# Altium project EVB_r2-1.PrjPCB (part 1 of 2)
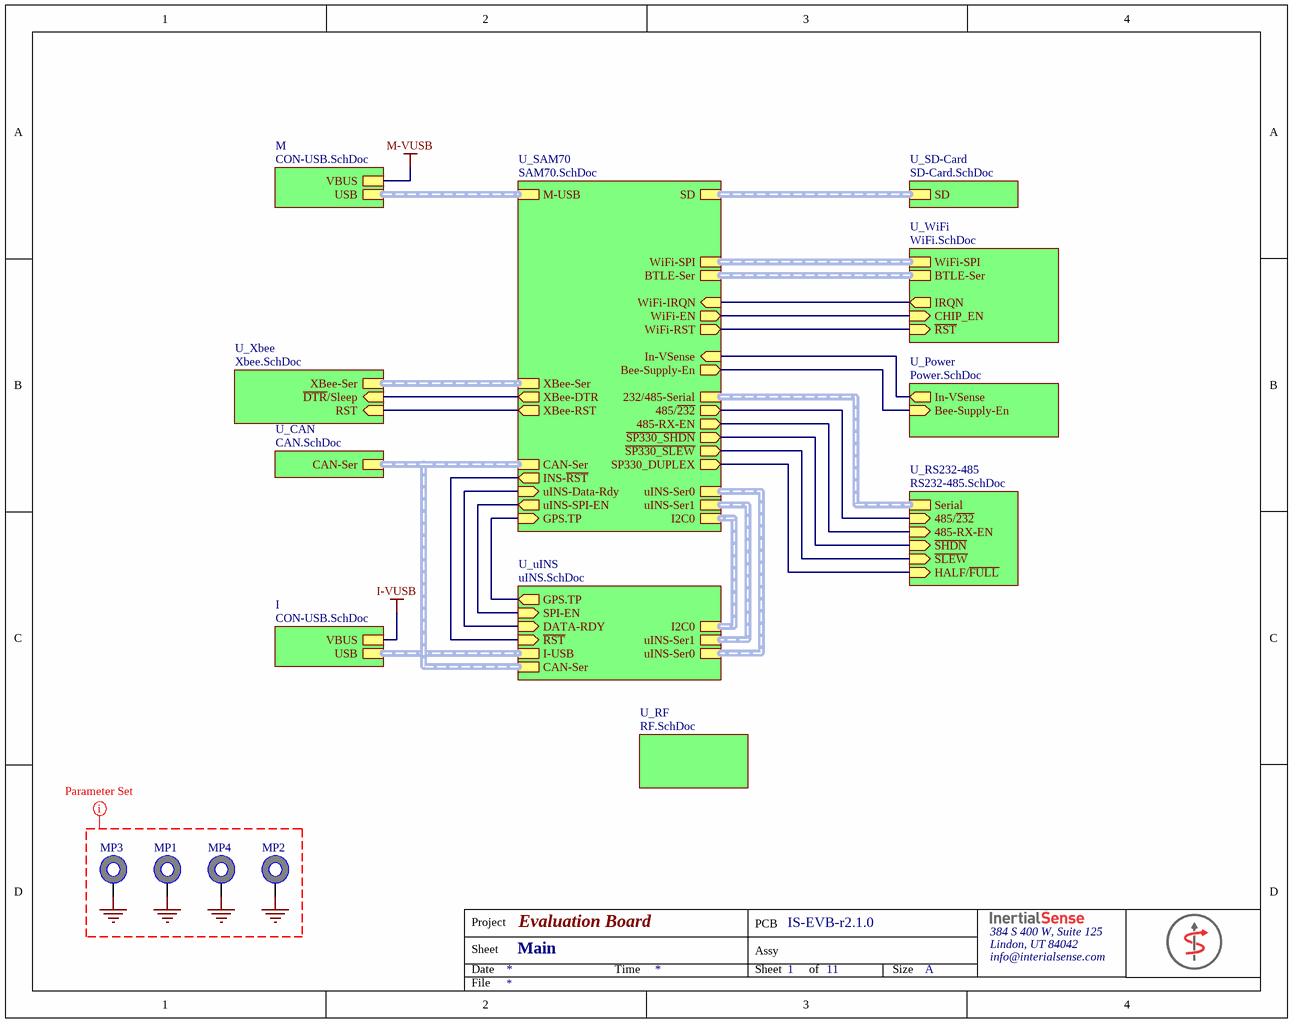
[diagram p0: Main.SchDoc]
AddressLine1: 384 S 400 W, Suite 125; AddressLine2: Lindon, UT 84042; AddressLine3: info@interialsense.com; Company: Inertial Sense, Inc.; PcbPartNumber: IS-EVB-r2.1.0; PcbRevision: 2.1; ProjectTitle: Evaluation Board
6 sheets, 107 parts. Net scope: hierarchical (ports join the sheet entries above them; power ports are global).
Board file: EVB-2.PCBDOC
Sheets:
  Main.SchDoc
    U_CAN = CAN.SchDoc
    U_SAM70 = SAM70.SchDoc
    U_uINS = uINS.SchDoc
    U_Xbee = Xbee.SchDoc
    M = CON-USB.SchDoc
    I = CON-USB.SchDoc

## Sheet Main.SchDoc: Main
size A; DocumentNumber: 1; SheetNumber: 1; SheetTotal: 11

### Parts
MP1  Standoff  [9774050151R]  (value not drawn)
MP2  Standoff  [9774050151R]  (value not drawn)
MP3  Standoff  [9774050151R]  (value not drawn)
MP4  Standoff  [9774050151R]  (value not drawn)

### Sub-sheets
I = CON-USB.SchDoc: USB (harness USB), VBUS
M = CON-USB.SchDoc: USB (harness USB), VBUS
U_CAN = CAN.SchDoc: CAN-Ser (harness CAN)
U_Power = Power.SchDoc (file not in this document): Bee-Supply-En (in), In-VSense (out)
U_RF = RF.SchDoc (file not in this document): no entries
U_RS232-485 = RS232-485.SchDoc (file not in this document): Serial (harness UART), 485/~{232} (in), 485-RX-EN (in), ~{SHDN} (in), ~{SLEW} (in), HALF/~{FULL} (in)
U_SAM70 = SAM70.SchDoc: M-USB (harness USB), I2C0 (harness I2C), CAN-Ser (harness CAN), uINS-Ser0 (harness UART), XBee-Ser (harness UART), uINS-Ser1 (harness USART), WiFi-SPI (harness SPI), BTLE-Ser (harness UART), SD (harness SDIO), XBee-DTR (out), WiFi-IRQN (in), WiFi-EN (out), WiFi-RST (out), XBee-RST (out), Bee-Supply-En (out), uINS-SPI-EN (out), 485/~{232} (out), uINS-Data-Rdy (in), GPS.TP (in), 232/485-Serial (harness UART), 485-RX-EN (out), ~{SP330_SHDN} (out), ~{SP330_SLEW} (out), SP330_DUPLEX (out), INS-~{RST} (out), In-VSense (in)
U_SD-Card = SD-Card.SchDoc (file not in this document): SD (harness SDIO)
U_uINS = uINS.SchDoc: uINS-Ser0 (harness UART), uINS-Ser1 (harness USART), I-USB (harness USB), I2C0 (harness I2C), ~{RST} (in), SPI-EN (in), DATA-RDY (in), GPS.TP (out), CAN-Ser (harness CAN)
U_WiFi = WiFi.SchDoc (file not in this document): CHIP_EN (in), WiFi-SPI (harness SPI), BTLE-Ser (harness UART), ~{RST} (in), IRQN (out)
U_Xbee = Xbee.SchDoc: RST (in), XBee-Ser (harness UART), ~{DTR}/Sleep (in)

### Nets
GND: MP1.1 MP2.1 MP3.1 MP4.1
485-RX-EN: sheet U_RS232-485/485-RX-EN, sheet U_SAM70/485-RX-EN
485/~{232}-SEL: sheet U_RS232-485/485/~{232}, sheet U_SAM70/485/~{232}
~{SP330-SHDN}: sheet U_RS232-485/~{SHDN}, sheet U_SAM70/~{SP330_SHDN}
GPS.TIMEPULSE: sheet U_SAM70/GPS.TP, sheet U_uINS/GPS.TP
I-DATA-RDY: sheet U_SAM70/uINS-Data-Rdy, sheet U_uINS/DATA-RDY
In-VSense: sheet U_Power/In-VSense, sheet U_SAM70/In-VSense
INS-~{RST}: sheet U_SAM70/INS-~{RST}, sheet U_uINS/~{RST}
SP330-DUPLEX: sheet U_RS232-485/HALF/~{FULL}, sheet U_SAM70/SP330_DUPLEX
SP330-SLEW: sheet U_RS232-485/~{SLEW}, sheet U_SAM70/~{SP330_SLEW}
uINS-SPI-EN: sheet U_SAM70/uINS-SPI-EN, sheet U_uINS/SPI-EN
WiFi-EN: sheet U_SAM70/WiFi-EN, sheet U_WiFi/CHIP_EN
WiFi-IRQN: sheet U_SAM70/WiFi-IRQN, sheet U_WiFi/IRQN
WiFi-RST: sheet U_SAM70/WiFi-RST, sheet U_WiFi/~{RST}
XBee-DTR: sheet U_SAM70/XBee-DTR, sheet U_Xbee/~{DTR}/Sleep
XBee-RST: sheet U_SAM70/XBee-RST, sheet U_Xbee/RST
XBee-Supply-En: sheet U_Power/Bee-Supply-En, sheet U_SAM70/Bee-Supply-En

### Buses and harness runs
harness sheet I/USB = sheet U_uINS/I-USB
harness sheet M/USB = sheet U_SAM70/M-USB
harness sheet U_CAN/CAN-Ser = sheet U_SAM70/CAN-Ser = sheet U_uINS/CAN-Ser
harness sheet U_RS232-485/Serial = sheet U_SAM70/232/485-Serial
harness sheet U_SAM70/BTLE-Ser = sheet U_WiFi/BTLE-Ser
harness sheet U_SAM70/I2C0 = sheet U_uINS/I2C0
harness sheet U_SAM70/SD = sheet U_SD-Card/SD
harness sheet U_SAM70/uINS-Ser0 = sheet U_uINS/uINS-Ser0
harness sheet U_SAM70/uINS-Ser1 = sheet U_uINS/uINS-Ser1
harness sheet U_SAM70/WiFi-SPI = sheet U_WiFi/WiFi-SPI
harness sheet U_SAM70/XBee-Ser = sheet U_Xbee/XBee-Ser

### Layout directives
net class Mounting Holes: GND

### Notes on the sheet
- Date
- Sheet
- Project
- Time
- PCB
- Assy
- of
- Size
- A
- File

### Library data of the parts
MP1-MP4 = Standoff: RND STANDOFF M2.5X0.45 STEEL 5MM; Manufacturer: Wurth Electronics; Manufacturer Part Number: 9774050951R; Plating: Tin; Threaded/Unthreaded: Unthreaded; Inside Diameter: 0.106inch; Outside Diameter: 0.201inch; Supplier 1: Digi-Key; Supplier Part Number 1: 732-7098-1-ND; Stock 1: 2378; Pricing 1: 1=0.95, 10=0.918, 50=0.795, 100=0.739 (USD); Material: Steel; Length: 0.252inch; REACH SVHC: Unknown

## Sheet CAN.SchDoc: CAN Transceiver
size A; DocumentNumber: 7; SheetNumber: 7; SheetTotal: 11
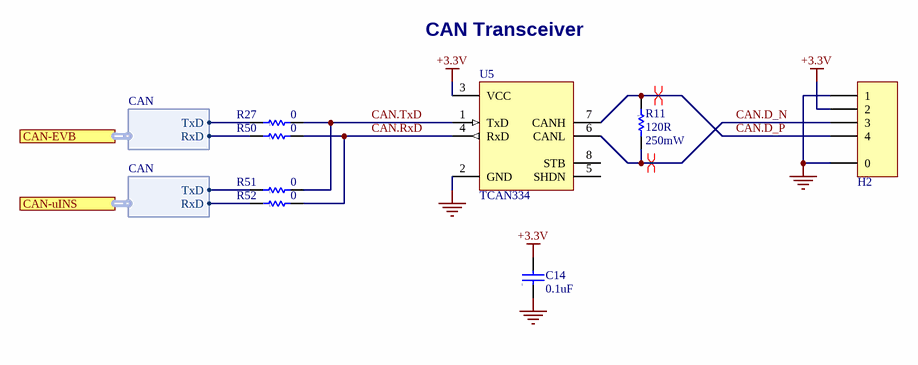
[diagram p1: CAN.SchDoc]

### Parts
C14  value 0.1uF  [0402]  (hidden comment: Cap)
H2  Hdr - 4pin - mount  [SM04B-GHS-TB(LF)(SN)]  (value not drawn)
R11  value 120R  Max Power Dissipation: 250mW  [R0603]  (hidden comment: Res)
R27  value 0  [R0402]  (hidden comment: Res)
R50  value 0  [R0402]  (hidden comment: Res)
R51  value 0  [R0402]  (hidden comment: Res)
R52  value 0  [R0402]  (hidden comment: Res)
U5  TCAN334  [SOT23-8-65P280X145-8N]

### Ports
CAN-EVB (harness CAN), CAN-uINS (harness CAN)

### Harnesses
CAN: TxD, RxD

### Nets
+3.3V: C14.2 H2.2 U5.3(VCC)
GND: C14.1 H2.0 H2.1 U5.2(GND)
CAN.D_N: H2.3 R11.2 U5.6(CANL)
CAN.D_P: H2.4 R11.1 U5.7(CANH)
CAN.RxD: R50.2 R52.2 U5.4(RxD)
CAN.TxD: R27.2 R51.2 U5.1(TxD)
NetR27_1: R27.1 ; port CAN-EVB.TxD
NetR50_1: R50.1 ; port CAN-EVB.RxD
NetR51_1: R51.1 ; port CAN-uINS.TxD
NetR52_1: R52.1 ; port CAN-uINS.RxD

Not connected (* = marked no-connect by the designer): U5 5(SHDN) 8(STB)

### Buses and harness runs
harness  = port CAN-EVB
harness  = port CAN-uINS

### Layout directives
differential pair; differential pair class CAN: CAN.D_N, CAN.D_P

### Notes on the sheet
- CAN Transceiver
- Date
- Sheet
- Project
- Time
- PCB
- Assy
- of
- Size
- A
- File

### Library data of the parts
C14 = Cap: CAP CER .10UF 50V X7R 10% 0402; Manufacturer: TDK Corporation; Manufacturer Part Number: C1005X7R1H104K; Capacitance: 0.1µF; Published: 8-Jun-2000; LatestRevisionDate: 17-Jul-2002; LatestRevisionNote: Re-released for DXP Platform.; Publisher: Altium Limited; Category: Capacitors; Supplier 1: Digi-Key; Supplier Part Number 1: 445-5932-1-ND; RoHS: RoHS Compliant; Stock 1: 174080; Pricing 1: 1=0.3, 10=0.2, 100=0.08, 250=0.05752, 500=0.041, 1000=0.03 (USD); Voltage - Rated: 50V; Tolerance: ±10%; Temperature Coefficient: X7R; Mounting Type: Surface Mount, MLCC; Operating Temperature: -55°C ~ 125°C; Applications: General Purpose; Ratings: -; Package / Case: 0402 (1005 Metric); Size / Dimension: 0.039" L x 0.020" W (1.00mm x 0.50mm); Height: -; Thickness: 0.022" (0.55mm); Lead Spacing: -; Features: -; Packaging: Cut Tape (CT); Lead Style: -; ComponentLink1URL: http://www.tdk.co.jp/tefe02/e412_c.pdf; ComponentLink1Description: http://www.tdk.co.jp/tefe02/e412_c.pdf
H2 = Hdr - 4pin - mount: CONN HEADER GH SIDE 4POS 1.25MM; Manufacturer: JST; Manufacturer Part Number: SM04B-GHS-TB(LF)(SN)-; Number of Positions: 4; Connector Type: Outer Shroud Contact; Pitch: 0.049inch; Supplier 1: Digi-Key; Supplier Part Number 1: 455-1566-1-ND; Stock 1: 1762; Pricing 1: 1=0.45, 10=0.423, 100=0.3244, 500=0.28212, 1000=0.23274 (USD); Mount: Surface Mount; Contact Plating: Tin; Colour: Natural; Number of Rows: 1; Packaging: Cut Tape; Termination: Solder; Fastening Type: Ramp
R11 = Res: RES SMD 120 OHM 5% 1/4W 0603; Manufacturer: Rohm; Manufacturer Part Number: ESR03EZPJ121; Temperature Coefficient: 200ppm/°C; Supplier 1: Digi-Key; Supplier Part Number 1: RHM120DDKR-ND; Stock 1: 89476; Pricing 1: 1=0.1, 10=0.087, 100=0.0333, 1000=0.01464, 2500=0.01264 (USD); Case/Package: 0603; Case Code (Metric): 1608; Case Code (Imperial): 0603; Min Operating Temperature: -55°C; Max Operating Temperature: 155°C; Tolerance: 5%; Package Quantity: 1; Resistance: 120R; Power Rating: 250mW; Packaging: Tape and Reel; Composition: Thick Film; Number of Terminations: 2; Length: 0.063inch; Height: 0.022inch; Width: 0.031inch; Lead Free: Lead Free; ComponentLink1URL: https://datasheet.ciiva.com/2495/esr-2495284.pdf; ComponentLink1Description: https://datasheet.ciiva.com/2495/esr-2495284.pdf; ComponentLink2URL: https://datasheet.ciiva.com/2495/esr-2495285.pdf; ComponentLink2Description: https://datasheet.ciiva.com/2495/esr-2495285.pdf; ComponentLink3URL: https://datasheet.ciiva.com/2495/esr-2495286.pdf; ComponentLink3Description: https://datasheet.ciiva.com/2495/esr-2495286.pdf
R27 R50-R52 = Res: RES SMD 0 OHM JUMPER 1/16W 0402; Manufacturer: Yageo; Manufacturer Part Number: RC0402JR-070RL; Resistor Case Style: 0402 [1005 Metric]; Resistance Tolerance: ± 5%; Resistor Element Type: Thick Film; SVHC: No SVHC (20-Jun-2016); Resistance: 0mR; Power Rating: 62.5mW; Tolerance: 5%; Voltage Rating: 50V; Max Power Dissipation: 63mW; Temperature Coefficient: 200ppm/°C; Product Range: -; Automotive Qualification Standard: -; MSL: MSL 1 - Unlimited; ComponentLink1URL: https://datasheet.ciiva.com/2452/pyu-rc0402-51-rohs-l-6-2452608.pdf; ComponentLink1Description: https://datasheet.ciiva.com/2452/pyu-rc0402-51-rohs-l-6-2452608.pdf; ComponentLink2URL: https://datasheet.ciiva.com/2452/pyu-r-int-thick-7-2452609.pdf; ComponentLink2Description: https://datasheet.ciiva.com/2452/pyu-r-int-thick-7-2452609.pdf; ComponentLink3URL: https://datasheet.ciiva.com/2452/pyu-r-int-thick-7-2452610.pdf; ComponentLink3Description: https://datasheet.ciiva.com/2452/pyu-r-int-thick-7-2452610.pdf; ComponentLink4URL: https://datasheet.ciiva.com/11808/0900766b80c66297-11808195.pdf; ComponentLink4Description: https://datasheet.ciiva.com/11808/0900766b80c66297-11808195.pdf; ComponentLink5URL: https://datasheet.ciiva.com/8896/pyu-rc0402-51-rohs-l-6-8896201.pdf; ComponentLink5Description: https://datasheet.ciiva.com/8896/pyu-rc0402-51-rohs-l-6-8896201.pdf; ComponentLink6URL: https://datasheet.ciiva.com/28386/pyu-rc0402-51-rohs-l-6-28386633.pdf; ComponentLink6Description: https://datasheet.ciiva.com/28386/pyu-rc0402-51-rohs-l-6-28386633.pdf; ComponentLink7URL: https://datasheet.ciiva.com/22747/1018594-22747515.pdf; ComponentLink7Description: https://datasheet.ciiva.com/22747/1018594-22747515.pdf; ComponentLink8URL: https://datasheet.ciiva.com/15189/getdatasheetpartid-326379-15189533.pdf; ComponentLink8Description: https://datasheet.ciiva.com/15189/getdatasheetpartid-326379-15189533.pdf; ComponentLink9URL: https://datasheet.ciiva.com/7983/1018594-7983535.pdf; ComponentLink9Description: https://datasheet.ciiva.com/7983/1018594-7983535.pdf; Supplier 1: Digi-Key; Supplier Part Number 1: 311-0.0JRDKR-ND; Stock 1: 39749506; Pricing 1: 1=0.1, 10=0.017, 25=0.0124, 50=0.0096, 100=0.007, 250=0.00536, 500=0.00428, 1000=0.00315, 5000=0.00226 (USD); Case/Package: 0402; Contact Plating: Matte,Tin; Case Code (Metric): 1005; Case Code (Imperial): 0402; Min Operating Temperature: -55°C; Max Operating Temperature: 155°C; Composition: Thick Film; Packaging: Tape and Reel; Package Quantity: 1; Number of Terminations: 2; Termination: SMD/SMT; Military Standard: Not; Features: Moisture Resistant; Length: 1mm; Height: 0.016inch; Width: 0.02inch; Depth: 0.5mm; Radiation Hardening: No; REACH SVHC: Unknown; Lead Free: Lead Free
U5 = TCAN334: IC TXRX CAN 3.3V SOT23-8; Manufacturer: Texas Instruments; Manufacturer Part Number: TCAN334DCNR; Supplier 1: Digi-Key; Supplier Part Number 1: 296-47830-1-ND; Stock 1: 2931; Pricing 1: 1=2.6, 10=2.336, 100=1.878, 500=1.54294, 1000=1.27844 (USD); Min Operating Temperature: -40°C; Max Operating Temperature: 125°C; Lead Free: Lead Free

## Sheet SAM70.SchDoc: MCU (ATSAME70)
size B; DocumentNumber: 2; SheetNumber: 2; SheetTotal: 11
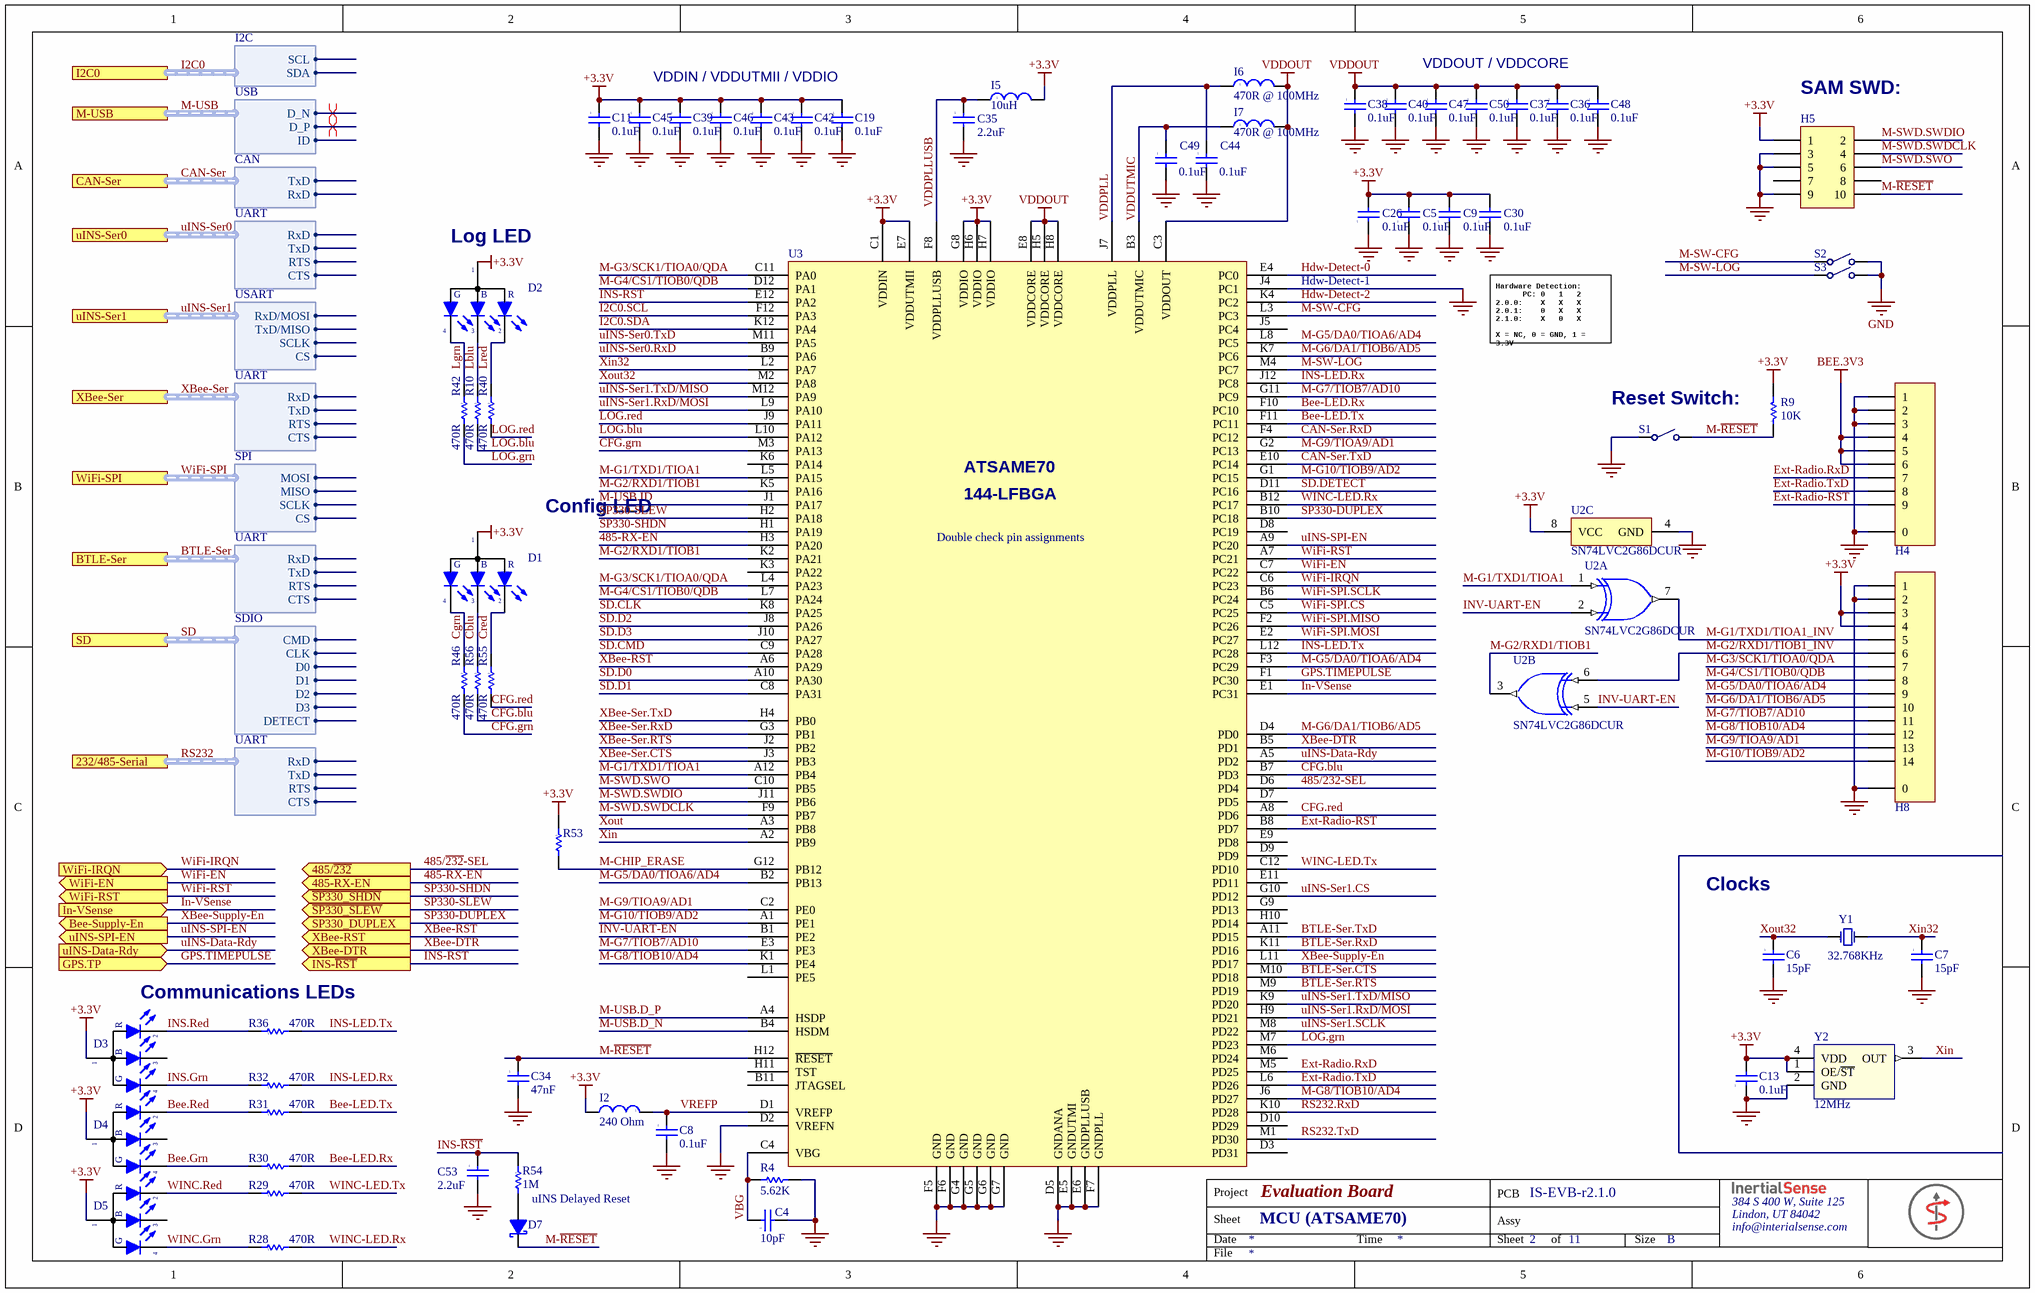
[diagram p2: SAM70.SchDoc]

### Parts
C4  value 10pF  [0402]  (hidden comment: Cap)
C5  value 0.1uF  [0402]  (hidden comment: Cap)
C6  value 15pF  [0402]  (hidden comment: Cap)
C7  value 15pF  [0402]  (hidden comment: Cap)
C8  value 0.1uF  [0201]  (hidden comment: Cap)
C9  value 0.1uF  [0402]  (hidden comment: Cap)
C11  value 0.1uF  [0201]  (hidden comment: Cap)
C13  value 0.1uF  [0402]  (hidden comment: Cap)
C19  value 0.1uF  [0201]  (hidden comment: Cap)
C26  value 0.1uF  [0402]  (hidden comment: Cap)
C30  value 0.1uF  [0402]  (hidden comment: Cap)
C34  value 47nF  [0402]  (hidden comment: Cap)
C35  Capacitance: 2.2uF  [0603]  (hidden comment: Cap)
C36  value 0.1uF  [0201]  (hidden comment: Cap)
C37  value 0.1uF  [0201]  (hidden comment: Cap)
C38  value 0.1uF  [0201]  (hidden comment: Cap)
C39  value 0.1uF  [0201]  (hidden comment: Cap)
C40  value 0.1uF  [0201]  (hidden comment: Cap)
C42  value 0.1uF  [0201]  (hidden comment: Cap)
C43  value 0.1uF  [0201]  (hidden comment: Cap)
C44  value 0.1uF  [0201]  (hidden comment: Cap)
C45  value 0.1uF  [0201]  (hidden comment: Cap)
C46  value 0.1uF  [0201]  (hidden comment: Cap)
C47  value 0.1uF  [0201]  (hidden comment: Cap)
C48  value 0.1uF  [0201]  (hidden comment: Cap)
C49  value 0.1uF  [0201]  (hidden comment: Cap)
C50  value 0.1uF  [0201]  (hidden comment: Cap)
C53  Capacitance: 2.2uF  [0603]  (hidden comment: Cap)
D1  LED-RGB  [LED0404]  (value not drawn)
D2  LED-RGB  [LED0404]  (value not drawn)
D3  LED-RGB  [LED0404]  (value not drawn)
D4  LED-RGB  [LED0404]  (value not drawn)
D5  LED-RGB  [LED0404]  (value not drawn)
D7  Diode - Schottky  [D0603B]  (value not drawn)
H4  Hdr - 9pin - mount  [SM09B-GHS-TB(LF)(SN)]  (value not drawn)
H5  Hdr - 5x2pin  [FTSH-105-01-L-DV-K-A-P]  (value not drawn)
H8  Hdr - 14pin - mount  [SM14B-GHS-TB(LF)(SN)]  (value not drawn)
I2  value 240 Ohm  [0201]  (hidden comment: Inductor)
I5  Inductance: 10uH  [0806]  (hidden comment: Inductor)
I6  value 470R @ 100MHz  [0402]  (hidden comment: Inductor)
I7  value 470R @ 100MHz  [0402]  (hidden comment: Inductor)
R4  value 5.62K  [R0402]  (hidden comment: Res)
R9  value 10K  [R0402]  (hidden comment: Res)
R10  value 470R  [R0402]  (hidden comment: Res)
R28  value 470R  [R0402]  (hidden comment: Res)
R29  value 470R  [R0402]  (hidden comment: Res)
R30  value 470R  [R0402]  (hidden comment: Res)
R31  value 470R  [R0402]  (hidden comment: Res)
R32  value 470R  [R0402]  (hidden comment: Res)
R36  value 470R  [R0402]  (hidden comment: Res)
R40  value 470R  [R0402]  (hidden comment: Res)
R42  value 470R  [R0402]  (hidden comment: Res)
R46  value 470R  [R0402]  (hidden comment: Res)
R53  Res  [R0402]  (value not drawn)
R54  value 1M  [R0402]  (hidden comment: Res)
R55  value 470R  [R0402]  (hidden comment: Res)
R56  value 470R  [R0402]  (hidden comment: Res)
S1  SPST Switch  [PTS810]  (value not drawn)
S2  SPST Switch  [PTS810]  (value not drawn)
S3  SPST Switch  [PTS810]  (value not drawn)
U2  SN74LVC2G86DCUR  [DCU0008A_N]  (parts A,B,C of 3)
U3  ATSAME70-144  [BGA144C80P12X12_1000X1000X140]  (value not drawn)
Y1  value 32.768KHz  [CRYMP2012X06L]  (hidden comment: Crystal)
Y2  value 12MHz  [ABM10_2.5_x_2.0]  (hidden comment: Oscillator2)

### Ports
232/485-Serial (harness UART), 485-RX-EN (out), 485/~{232} (out), Bee-Supply-En (out), BTLE-Ser (harness UART), CAN-Ser (harness CAN), GPS.TP (in), I2C0 (harness I2C), In-VSense (in), INS-~{RST} (out), M-USB (harness USB), SD (harness SDIO), SP330_DUPLEX (out), uINS-Data-Rdy (in), uINS-Ser0 (harness UART), uINS-Ser1 (harness USART), uINS-SPI-EN (out), WiFi-EN (out), WiFi-IRQN (in), WiFi-RST (out), WiFi-SPI (harness SPI), XBee-DTR (out), XBee-RST (out), XBee-Ser (harness UART), ~{SP330_SHDN} (out), ~{SP330_SLEW} (out)

### Harnesses
I2C: SCL, SDA
CAN: TxD, RxD
UART: RxD, TxD, RTS, CTS
UART: RxD, TxD, CTS, RTS
USART: RxD/MOSI, TxD/MISO, CS, SCLK
SPI: MOSI, MISO, CS, SCLK
SDIO: CMD, CLK, D1, D0, D2, D3, DETECT
USB: D_N, D_P, ID

### Nets
+3.3V: C5.2 C9.2 C11.1 C13.2 C19.1 C26.2 C30.2 C39.1 C42.1 C43.1 C45.1 C46.1 D1.1 D2.1 D3.1 D4.1 D5.1 H5.1 H8.3 H8.4 I2.2 I5.2 R9.2 R53.1 U2.8(VCC) U3.C1(VDDIN) U3.E7(VDDUTMII) U3.G8(VDDIO) U3.H6(VDDIO) U3.H7(VDDIO) Y2.1(OE/~{ST}) Y2.4(VDD)
BEE.3V3: H4.4 H4.5 H4.6
GND: C4.2 C5.1 C6.2 C7.2 C8.2 C9.1 C11.2 C13.1 C19.2 C26.1 C30.1 C34.2 C35.2 C36.2 C37.2 C38.2 C39.2 C40.2 C42.2 C43.2 C44.2 C45.2 C46.2 C47.2 C48.2 C49.2 C50.2 C53.2 H4.0 H4.1 H4.2 H4.3 H5.3 H5.5 H5.9 H8.0 H8.1 H8.2 R4.2 S1.1 S2.2 S3.2 U2.4(GND) U3.D2(VREFN) U3.D5(GNDANA) U3.E5(GNDUTMI) U3.E6(GNDPLLUSB) U3.F5(GND) U3.F6(GND) U3.F7(GNDPLL) U3.G4(GND) U3.G5(GND) U3.G6(GND) U3.G7(GND) U3.J4(PC1) Y2.2(GND)
VDDOUT: C36.1 C37.1 C38.1 C40.1 C47.1 C48.1 C50.1 I6.2 I7.2 U3.C3(VDDOUT) U3.E8(VDDCORE) U3.H5(VDDCORE) U3.H8(VDDCORE)
485-RX-EN: U3.H3(PA20) ; port 485-RX-EN
485/~{232}-SEL: U3.D6(PD4) ; port 485/~{232}
~{SP330-SHDN}: U3.H1(PA19) ; port ~{SP330_SHDN}
Bee-LED.Rx: R30.2 U3.F10(PC10)
Bee-LED.Tx: R31.2 U3.F11(PC11)
Bee.Grn: D4.4 R30.1
Bee.Red: D4.2 R31.1
BTLE-Ser.CTS: U3.M10(PD18)
BTLE-Ser.RTS: U3.M9(PD19)
BTLE-Ser.RxD: U3.K11(PD16)
BTLE-Ser.TxD: U3.A11(PD15)
CAN-Ser.RxD: U3.F4(PC12)
CAN-Ser.TxD: U3.E10(PC14)
Cblu: D1.3 R56.1
CFG.blu: R56.2 U3.B7(PD3)
CFG.grn: R46.2 U3.M3(PA13)
CFG.red: R55.2 U3.A8(PD6)
Cgrn: D1.4 R46.1
Cred: D1.2 R55.1
Ext-Radio-RST: H4.9 U3.B8(PD7)
Ext-Radio.RxD: H4.7 U3.M5(PD25)
Ext-Radio.TxD: H4.8 U3.L6(PD26)
GPS.TIMEPULSE: U3.F1(PC30) ; port GPS.TP
Hdw-Detect-0: U3.E4(PC0)
Hdw-Detect-2: U3.K4(PC2)
I2C0.SCL: U3.F12(PA3)
I2C0.SDA: U3.K12(PA4)
In-VSense: U3.E1(PC31) ; port In-VSense
INS-LED.Rx: R32.2 U3.J12(PC8)
INS-LED.Tx: R36.2 U3.L12(PC28)
INS-~{RST}: C53.1 R54.1 U3.E12(PA2) ; port INS-~{RST}
INS.Grn: D3.4 R32.1
INS.Red: D3.2 R36.1
INV-UART-EN: U2.2(1B) U2.5(2A) U3.B1(PE2)
Lblu: D2.3 R10.1
Lgrn: D2.4 R42.1
LOG.blu: R10.2 U3.L10(PA12)
LOG.grn: R42.2 U3.M7(PD23)
LOG.red: R40.2 U3.J9(PA11)
Lred: D2.2 R40.1
M-CHIP_ERASE: R53.2 U3.G12(PB12)
M-G1/TXD1/TIOA1: U2.1(1A) U3.A12(PB4) U3.L5(PA15)
M-G1/TXD1/TIOA1_INV: H8.5 U2.7(1Y)
M-G2/RXD1/TIOB1: U2.3(2Y) U3.K2(PA21) U3.K5(PA16)
M-G2/RXD1/TIOB1_INV: H8.6 U2.6(2B)
M-G3/SCK1/TIOA0/QDA: H8.7 U3.C11(PA0) U3.L4(PA23)
M-G4/CS1/TIOB0/QDB: H8.8 U3.D12(PA1) U3.L7(PA24)
M-G5/DA0/TIOA6/AD4: H8.9 U3.B2(PB13) U3.F3(PC29) U3.L8(PC5)
M-G6/DA1/TIOB6/AD5: H8.10 U3.D4(PD0) U3.K7(PC6)
M-G7/TIOB7/AD10: H8.11 U3.E3(PE3) U3.G11(PC9)
M-G8/TIOB10/AD4: H8.12 U3.J6(PD27) U3.K1(PE4)
M-G9/TIOA9/AD1: H8.13 U3.C2(PE0) U3.G2(PC13)
M-G10/TIOB9/AD2: H8.14 U3.A1(PE1) U3.G1(PC15)
M-~{RESET}: C34.1 D7.C H5.10 R9.1 S1.2 U3.H12(~{RESET})
M-SW-CFG: S2.1 U3.L3(PC3)
M-SW-LOG: S3.1 U3.M4(PC7)
M-SWD.SWDCLK: H5.4 U3.F9(PB7)
M-SWD.SWDIO: H5.2 U3.J11(PB6)
M-SWD.SWO: H5.6 U3.C10(PB5)
M-USB.D_N: U3.B4(HSDM)
M-USB.D_P: U3.A4(HSDP)
M-USB.ID: U3.J1(PA17)
RS232.RxD: U3.K10(PD28)
RS232.TxD: U3.M1(PD30)
SD.CLK: U3.K8(PA25)
SD.CMD: U3.C9(PA28)
SD.D0: U3.A10(PA30)
SD.D1: U3.C8(PA31)
SD.D2: U3.J8(PA26)
SD.D3: U3.J10(PA27)
SD.DETECT: U3.D11(PC16)
SP330-DUPLEX: U3.B10(PC18) ; port SP330_DUPLEX
SP330-SLEW: U3.H2(PA18) ; port ~{SP330_SLEW}
uINS-Data-Rdy: U3.A5(PD2) ; port uINS-Data-Rdy  [project net I-DATA-RDY]
uINS-Ser0.RxD: U3.B9(PA6)
uINS-Ser0.TxD: U3.M11(PA5)
uINS-Ser1.CS: U3.G10(PD12)
uINS-Ser1.RxD/MOSI: U3.H9(PD21) U3.L9(PA10)
uINS-Ser1.SCLK: U3.M8(PD22)
uINS-Ser1.TxD/MISO: U3.K9(PD20) U3.M12(PA9)
uINS-SPI-EN: U3.A9(PC20) ; port uINS-SPI-EN
VBG: C4.1 R4.1 U3.C4(VBG)
VDDPLL: C44.1 I6.1 U3.J7(VDDPLL)
VDDPLLUSB: C35.1 I5.1 U3.F8(VDDPLLUSB)
VDDUTMIC: C49.1 I7.1 U3.B3(VDDUTMIC)
VREFP: C8.1 I2.1 U3.D1(VREFP)
WiFi-EN: U3.C7(PC22) ; port WiFi-EN
WiFi-IRQN: U3.C6(PC23) ; port WiFi-IRQN
WiFi-RST: U3.A7(PC21) ; port WiFi-RST
WiFi-SPI.CS: U3.C5(PC25)
WiFi-SPI.MISO: U3.F2(PC26)
WiFi-SPI.MOSI: U3.E2(PC27)
WiFi-SPI.SCLK: U3.B6(PC24)
WINC-LED.Rx: R28.2 U3.B12(PC17)
WINC-LED.Tx: R29.2 U3.C12(PD10)
WINC.Grn: D5.4 R28.1
WINC.Red: D5.2 R29.1
XBee-DTR: U3.B5(PD1) ; port XBee-DTR
XBee-RST: U3.A6(PA29) ; port XBee-RST
XBee-Ser.CTS: U3.J3(PB3)
XBee-Ser.RTS: U3.J2(PB2)
XBee-Ser.RxD: U3.G3(PB1)
XBee-Ser.TxD: U3.H4(PB0)
XBee-Supply-En: U3.L11(PD17) ; port Bee-Supply-En
Xin: U3.A2(PB9) Y2.3(OUT)
Xin32: C7.1 U3.L2(PA7) Y1.2
Xout: U3.A3(PB8)
Xout32: C6.1 U3.M2(PA8) Y1.1
NetD7_A: D7.A R54.2

Not connected (* = marked no-connect by the designer): D3 3; D4 3; D5 3; H5 7 8; U3 B11(JTAGSEL) D3(PD31) D7(PD5) D8(PC19) D9(PD9) D10(PD29) E9(PD8) E11(PD11) G9(PD13) H10(PD14) H11(TST) J5(PC4) K3(PA22) K6(PA14) L1(PE5) M6(PD24)

### Buses and harness runs
harness BTLE-Ser = port BTLE-Ser
harness CAN-Ser = port CAN-Ser
harness I2C0 = port I2C0
harness M-USB = port M-USB
harness RS232 = port 232/485-Serial
harness SD = port SD
harness uINS-Ser0 = port uINS-Ser0
harness uINS-Ser1 = port uINS-Ser1
harness WiFi-SPI = port WiFi-SPI
harness XBee-Ser = port XBee-Ser

### Layout directives
differential pair: M-USB.D_N, M-USB.D_P

### Notes on the sheet
- VDDIN / VDDUTMII / VDDIO
- VDDOUT / VDDCORE
- (near H5) SAM SWD:
- (near D2) Log LED
- Hdw-Detect-1
- Hardware Detection:
  PC: 0   1   2
  2.0.0:    X   X   X
  2.0.1:    0   X   X
  2.1.0:    X   0   X
  X = NC, 0 = GND, 1 = 3.3V
- Reset Switch:
- (near D1) Config LED
- Clocks
- Communications LEDs
- uINS Delayed Reset
- Date
- Sheet
- Project
- Time
- PCB
- Assy
- of
- Size
- B
- File
- (in symbol ATSAME70-144) ATSAME70; 144-LFBGA; Double check pin assignments
- (in symbol LED-RGB) G; B; R

### Library data of the parts
C4 = Cap: CAP CER 10PF 50V C0G 0402; Manufacturer: TDK; Manufacturer Part Number: C1005C0G1H100D050BA; Dielectric Material: Ceramic; Temperature Coefficient: 30ppm/°C; Published: 8-Jun-2000; LatestRevisionDate: 17-Jul-2002; LatestRevisionNote: Re-released for DXP Platform.; Publisher: Altium Limited; Category: Capacitors; Supplier 1: Digi-Key; Supplier Part Number 1: 445-1235-6-ND; Stock 1: 0; Pricing 1: 1=0.1, 10=0.027, 100=0.012, 500=0.00858, 1000=0.00674, 2500=0.00612, 5000=0.00564 (USD); Mount: Surface Mount; Case/Package: 0402; Number of Pins: 2; Weight: 2.3E-05oz; Case Code (Metric): 1005; Case Code (Imperial): 0402; Min Operating Temperature: -55°C; Max Operating Temperature: 125°C; Capacitance: 10pF; Voltage Rating: 50V; Package Quantity: 1; Packaging: Tape and Reel; Voltage Rating (DC): 50V; Dielectric: C0G; Termination: SMD/SMT; Voltage: 50V; Length: 1mm; Height: 0.5mm; Width: 0.02inch; Depth: 0.5mm; Thickness: 0.022inch; Radiation Hardening: No; REACH SVHC: No SVHC; Lead Free: Lead Free
C5 C9 C13 C26 C30 = Cap: as C14 on sheet CAN; Published: 8-Jun-2000; LatestRevisionDate: 17-Jul-2002; LatestRevisionNote: Re-released for DXP Platform.; Publisher: Altium Limited; Category: Capacitors; Supplier 1: Digi-Key; Supplier Part Number 1: 445-5932-1-ND; RoHS: RoHS Compliant; Stock 1: 174080; Pricing 1: 1=0.3, 10=0.2, 100=0.08, 250=0.05752, 500=0.041, 1000=0.03 (USD); Voltage - Rated: 50V; Tolerance: ±10%; Temperature Coefficient: X7R; Mounting Type: Surface Mount, MLCC; Operating Temperature: -55°C ~ 125°C; Applications: General Purpose; Ratings: -; Package / Case: 0402 (1005 Metric); Size / Dimension: 0.039" L x 0.020" W (1.00mm x 0.50mm); Height: -; Thickness: 0.022" (0.55mm); Lead Spacing: -; Features: -; Packaging: Cut Tape (CT); Lead Style: -; ComponentLink1URL: http://www.tdk.co.jp/tefe02/e412_c.pdf; ComponentLink1Description: http://www.tdk.co.jp/tefe02/e412_c.pdf
C6 C7 = Cap: CAP CER 15PF 16V C0G/NP0 0402; Manufacturer: KEMET; Manufacturer Part Number: C0402C150J4GACTU; Dielectric Material: Ceramic; Tolerance: 5%; Dielectric: C0G; Dissipation Factor: 0.1%; Published: 8-Jun-2000; LatestRevisionDate: 17-Jul-2002; LatestRevisionNote: Re-released for DXP Platform.; Publisher: Altium Limited; Category: Capacitors; Supplier 1: Digi-Key; Supplier Part Number 1: 399-8947-6-ND; Stock 1: 94634; Pricing 1: 1=0.1, 10=0.028, 100=0.0127, 500=0.00906, 1000=0.00712, 2500=0.00647, 5000=0.00595 (USD); Mount: Surface Mount; Case/Package: 0402; Case Code (Metric): 1005; Case Code (Imperial): 0402; Min Operating Temperature: -55°C; Max Operating Temperature: 125°C; Capacitance: 15pF; Voltage Rating: 16V; Packaging: Tape and Reel; Package Quantity: 1; Voltage Rating (DC): 16V; Termination: SMD/SMT; Length: 1mm; Height: 0.5mm; Width: 0.02inch; Thickness: 0.022inch; Depth: 0.5mm; Lead Pitch: 0.3mm; REACH SVHC: No SVHC; Lead Free: Lead Free
C8 C11 C19 C36-C40 C42-C50 = Cap: CAP CER 0.1UF 25V X5R 0201; Manufacturer: Murata; Manufacturer Part Number: GRM033R6YA104KE14D; Capacitance: 100nF; Tolerance: 10%; Voltage Rating (DC): 35V; Published: 8-Jun-2000; LatestRevisionDate: 17-Jul-2002; LatestRevisionNote: Re-released for DXP Platform.; Publisher: Altium Limited; Category: Capacitors; Supplier 1: Digi-Key; Supplier Part Number 1: 490-10430-1-ND; Stock 1: 150000; Pricing 1: 1=0.1, 10=0.066, 100=0.0296, 500=0.02114, 1000=0.0166, 2500=0.01509, 5000=0.01389 (USD); Mount: Surface Mount; Case/Package: 0201; Weight: 1.2E-05oz; Case Code (Metric): 0603; Case Code (Imperial): 0201; Min Operating Temperature: -55°C; Max Operating Temperature: 85°C; Dielectric: X5R; Packaging: Tape and Reel; Voltage Rating: 35V; Termination: SMD/SMT; Package Quantity: 15000; Length: 0.024inch; Height: 0.3mm; Width: 0.3mm; Thickness: 0.013inch
C34 = Cap: CAP CER 0.047UF 16V Y5V 0402; Manufacturer: Yageo; Manufacturer Part Number: CC0402ZRY5V7BB473; Dielectric Material: Ceramic; Tolerance: 80%; Insulation Resistance: 100GR; Published: 8-Jun-2000; LatestRevisionDate: 17-Jul-2002; LatestRevisionNote: Re-released for DXP Platform.; Publisher: Altium Limited; Category: Capacitors; Supplier 1: Digi-Key; Supplier Part Number 1: 311-1046-6-ND; Stock 1: 0; Pricing 1: 1=0.1, 10=0.037, 100=0.0165, 500=0.01178, 1000=0.00926, 2500=0.00842, 5000=0.00774 (USD); Mount: Surface Mount; Case/Package: 0402; Number of Pins: 2; Case Code (Metric): 1005; Case Code (Imperial): 0402; Min Operating Temperature: -30°C; Max Operating Temperature: 85°C; Capacitance: 47nF; Voltage Rating: 16V; Dielectric: Y5V; Voltage Rating (DC): 16V; Packaging: Tape and Reel; Package Quantity: 10000; Termination: SMD/SMT; Composition: Ceramic; Length: 1mm; Height: 0.5mm; Width: 0.02inch; Depth: 0.5mm; Thickness: 0.022inch; Radiation Hardening: No; REACH SVHC: No SVHC; Lead Free: Lead Free; Halogen Free: Halogen Free
C35 C53 = Cap: CAP CER 2.2UF 6.3V X5R 0603; Manufacturer: Samsung; Manufacturer Part Number: CL10A225KQ8NNWC; Tolerance: 10%; ComponentLink1URL: https://datasheet.ciiva.com/25798/cl21b225kafnfne-25798721.pdf; ComponentLink1Description: https://datasheet.ciiva.com/25798/cl21b225kafnfne-25798721.pdf; Supplier 1: Digi-Key; Supplier Part Number 1: 1276-1886-1-ND; Stock 1: 40000; Pricing 1: 1=0.13, 10=0.096, 100=0.0429, 500=0.03062, 1000=0.02406 (USD); Mount: Surface Mount; Case/Package: 0603; Case Code (Metric): 1608; Case Code (Imperial): 0603; Min Operating Temperature: -55°C; Max Operating Temperature: 85°C; Package Quantity: 4000; Packaging: Cut Tape; Voltage Rating: 6.3V; Length: 0.063inch; Width: 0.031inch; Thickness: 0.035inch
D1-D5 = LED-RGB: LED RGB DIFFUSED 0404 SMD; Manufacturer: Rohm Semiconductor; Manufacturer Part Number: SMLP34RGB2W3; Color: Red, Green, Blue (RGB); Lens Color: White; Millicandela Rating: 35mcd Red, 110mcd Green, 45mcd Blue; Lens Style/Size: Rectangle with Flat Top, 1.00mm x 0.60mm; Voltage - Forward (Vf) (Typ): 2.1V Red, 3.1V Green, 3V Blue; Current - Test: 5mA Red, 5mA Green, 5mA Blue; Wavelength - Dominant: 624nm Red, 527nm Green, 470nm Blue; Published: 8-Jun-2000; LatestRevisionDate: 08-Jul-2005; LatestRevisionNote: Mech Layer 1 removed.; PackageReference: LED-0; Publisher: Altium Limited; Supplier 1: Digi-Key; Supplier Part Number 1: SMLP34RGB2W3TR-ND; RoHS: RoHS Compliant; Category: Optoelectronics; Stock 1: 55000; Pricing 1: 5000=0.297, 10000=0.2926, 25000=0.286, 50000=0.275, 125000=0.264 (USD); Packaging: Tape & Reel (TR); Lens Transparency: Diffused; Viewing Angle: -; Mounting Type: Surface Mount; Wavelength - Peak: -; Features: -; Package / Case: 0404 (1010 Metric); Supplier Device Package: PICOLED; Size / Dimension: 1.00mm L x 1.00mm W; Height (Max): 0.25mm; ComponentLink1URL: http://rohmfs.rohm.com/en/products/databook/datasheet/opto/led/chip_multi/smlp34.pdf; ComponentLink1Description: http://rohmfs.rohm.com/en/products/databook/datasheet/opto/led/chip_multi/smlp34.pdf
D7 = Diode - Schottky: DIODE SCHOTTKY 30V 2A 0603; Manufacturer: Vishay; Manufacturer Part Number: VSKY20301608-G4-08; Supplier 1: Digi-Key; Supplier Part Number 1: VSKY20301608-G4-08GICT-ND; Stock 1: 13064; Pricing 1: 1=0.38, 10=0.305, 25=0.2792, 100=0.2076, 250=0.1882, 500=0.15574, 1000=0.1168, 2500=0.10707 (USD); ComponentLink1URL: http://www.mouser.com/ds/2/427/vsky20301608-777242.pdf; ComponentLink1Description: http://www.mouser.com/ds/2/427/vsky20301608-777242.pdf
H4 = Hdr - 9pin - mount: CONN HEADER GH SIDE 9POS 1.25MM; Manufacturer: JST; Number of Positions: 9; Connector Type: Outer Shroud Contact; Pitch: 0.049inch; Supplier 1: Digi-Key; Supplier Part Number 1: 455-1571-2-ND; Manufacturer Part Number: SM09B-GHS-TB(LF)(SN); Stock 1: 0; Mount: Surface Mount; Contact Plating: Tin; Colour: Natural; Contact Material: Bronze; Housing Colour: Natural; Housing Material: Nylon; Number of Rows: 1; Packaging: Cut Tape; Fastening Type: Ramp; Termination: Solder; Number of Contacts: 9; Lead Free: Lead Free
H5 = Hdr - 5x2pin: CONN HEADER 10POS DUAL .05" SMD; Manufacturer: Samtec; Number of Contacts: 10; Gender: Male; Pitch: 1.27mm; ComponentLink1URL: http://www.samtec.com/documents/webfiles/pdf/FTSH_SMT.pdf; ComponentLink1Description: http://www.samtec.com/documents/webfiles/pdf/FTSH_SMT.pdf; Supplier 1: Digi-Key; Supplier Part Number 1: SAM9440-ND; Manufacturer Part Number: FTSH-105-01-L-DV-K-A-P; Stock 1: 3679; Pricing 1: 1=4.15, 92=3.48598, 184=3.32, 552=2.82199, 1012=2.407 (USD); Contact Plating: Gold; Contact Material: Bronze; Housing Colour: Black; Housing Material: Polymer; Min Operating Temperature: -55°C; Max Operating Temperature: 125°C; Number of Rows: 2; Packaging: Bulk; Termination: Solder; Orientation: Straight; Length: 6.35mm; Depth: 3.43mm; Radiation Hardening: No; Lead Free: Lead Free
H8 = Hdr - 14pin - mount: CONN HEADER GH SIDE 14POS 1.25MM; Manufacturer: JST; Number of Positions: 14; Connector Type: Outer Shroud Contact; Current Rating: 1A; Voltage Rating (AC): 50V; Gender: Male; Pitch: 0.049inch; Wire/Cable Gauge: 26AWG; Supplier 1: Digi-Key; Supplier Part Number 1: 455-1576-6-ND; Manufacturer Part Number: SM14B-GHS-TB(LF)(SN); Stock 1: 0; Mount: Surface Mount; Contact Plating: Tin; Colour: Natural; Contact Material: Bronze; Housing Colour: Natural; Housing Material: Nylon; Min Operating Temperature: -25°C; Max Operating Temperature: 85°C; Number of Rows: 1; Packaging: Tape and Reel; Termination: Solder; Fastening Type: Ramp; Number of Contacts: 14; REACH SVHC: No SVHC; Lead Free: Lead Free
I2 = Inductor: FERRITE BEAD 240 OHM 0201 1LN; Manufacturer: TDK Corporation; Manufacturer Part Number: MMZ0603S241HT000; Filter Type: Signal Line; Number of Lines: 1; Impedance @ Frequency: 240 Ohm @ 100MHz; Current Rating (Max): 420mA; DC Resistance (DCR) (Max): 320 mOhm; Supplier 1: Digi-Key; Supplier Part Number 1: 445-172341-1-ND; RoHS: RoHS Compliant; Category: Filters; Stock 1: 16894; Pricing 1: 1=0.13, 10=0.109, 100=0.0605, 250=0.0484, 500=0.04356, 1000=0.0363, 5000=0.03388 (USD); Packaging: Cut Tape (CT); Ratings: -; Operating Temperature: -55°C ~ 125°C; Package / Case: 0201 (0603 Metric); Mounting Type: Surface Mount; Height (Max): 0.013" (0.33mm); Size / Dimension: 0.024" L x 0.012" W (0.60mm x 0.30mm); ComponentLink1URL: https://product.tdk.com/info/en/catalog/datasheets/beads_commercial_signal_mmz0603_en.pdf; ComponentLink1Description: https://product.tdk.com/info/en/catalog/datasheets/beads_commercial_signal_mmz0603_en.pdf
I5 = Inductor: FIXED IND 10UH 350MA 1.066 OHM; Manufacturer: Taiyo Yuden; Manufacturer Part Number: CBC2016T100M; Core Material: Ferrite; Self Resonant Frequency: 32MHz; Tolerance: 20%; DC Resistance (DCR): 1.066R; Test Frequency: 2.52MHz; Saturation Current: 380mA; Shielding: Unshielded; ComponentLink1URL: https://datasheet.ciiva.com/8505/brc2016t100k-ss-8505634.pdf; ComponentLink1Description: https://datasheet.ciiva.com/8505/brc2016t100k-ss-8505634.pdf; ComponentLink2URL: https://datasheet.ciiva.com/7648/wound07-e-7648376.pdf; ComponentLink2Description: https://datasheet.ciiva.com/7648/wound07-e-7648376.pdf; ComponentLink3URL: https://datasheet.ciiva.com/6701/wound07-e-6701195.pdf; ComponentLink3Description: https://datasheet.ciiva.com/6701/wound07-e-6701195.pdf; ComponentLink4URL: https://datasheet.ciiva.com/6701/wound07-e-6701196.pdf; ComponentLink4Description: https://datasheet.ciiva.com/6701/wound07-e-6701196.pdf; ComponentLink5URL: https://datasheet.ciiva.com/6701/wound07-e-6701197.pdf; ComponentLink5Description: https://datasheet.ciiva.com/6701/wound07-e-6701197.pdf; Supplier 1: Digi-Key; Supplier Part Number 1: 587-1606-1-ND; Stock 1: 43283; Pricing 1: 1=0.25, 10=0.221, 100=0.1518, 500=0.12972, 1000=0.09936 (USD); Mount: Surface Mount; Case/Package: 0806; Number of Pins: 2; Case Code (Metric): 2016; Case Code (Imperial): 0806; Min Operating Temperature: -40°C; Max Operating Temperature: 105°C; Packaging: Tape and Reel; Max DC Current: 350mA; Termination: SMD/SMT; Inductance Tolerance: 20%; Package Quantity: 2000; Current Rating: 350mA; Composition: Wirewound; DC Current: 350mA; Military Standard: Not; Length: 0.079inch; Height: 1.6mm; Width: 0.063inch; Height - Seated (Max): 0.071inch; Depth: 1.8mm; Radiation Hardening: No; REACH SVHC: Unknown; Halogen Free: Halogen Free; Lead Free: Lead Free
I6 I7 = Inductor: FERRITE BEAD 470 OHM 0402; Manufacturer: Taiyo Yuden; Manufacturer Part Number: BK1005HM471-T; Impedance: 470R; DC Resistance (DCR): 450mR; Max DC Current: 250mA; Test Frequency: 100MHz; Tolerance: 25%; Number of Lines: 1; Shielding: Unshielded; Supplier 1: Digi-Key; Supplier Part Number 1: 587-1838-6-ND; Stock 1: 18500; Pricing 1: 1=0.1, 10=0.041, 25=0.0364, 50=0.033, 100=0.0297, 250=0.0218, 500=0.01584, 1000=0.01551, 5000=0.01056 (USD); Mount: Surface Mount; Case/Package: 0402; Number of Pins: 2; Case Code (Metric): 1005; Case Code (Imperial): 0402; Core Material: Ferrite; Min Operating Temperature: -55°C; Max Operating Temperature: 125°C; Packaging: Tape and Reel; Package Quantity: 10; Termination: SMD/SMT; Max Current Rating: 250mA; Frequency: 100MHz; Length: 0.039inch; Height: 0.022inch; Width: 0.02inch; Depth: 0.55mm; Lead Free: Lead Free; Halogen Free: Halogen Free
R4 = Res: RES SMD 5.62K OHM 1% 1/10W 0402; Manufacturer: Panasonic; Manufacturer Part Number: ERJ-2RKF5621X; Power Rating: 100mW; Resistance: 5.62kR; Voltage Rating: 50V; Temperature Coefficient: 100ppm/°C; Supplier 1: Digi-Key; Supplier Part Number 1: P5.62KLDKR-ND; Stock 1: 642946; Pricing 1: 1=0.1, 10=0.045, 100=0.0184, 1000=0.00826, 2500=0.00717, 5000=0.00593 (USD); Mount: Surface Mount; Case/Package: 0402; Case Code (Metric): 1005; Case Code (Imperial): 0402; Contact Plating: Tin; Min Operating Temperature: -55°C; Max Operating Temperature: 155°C; Tolerance: 1%; Packaging: Tape and Reel; Package Quantity: 1; Composition: Thick Film; Number of Terminations: 2; Termination: SMD/SMT; Military Standard: Not; Voltage Rating (DC): 50V; Max Power Dissipation: 100mW; Features: Automotive AEC-Q200; Length: 1mm; Height: 0.016inch; Width: 0.02inch; Depth: 0.5mm; Radiation Hardening: No; REACH SVHC: No SVHC; Lead Free: Lead Free
R9 = Res: RES 10K OHM 1/16W 1% 0402 SMD; Manufacturer: Panasonic; Manufacturer Part Number: ERJ-2RKF1002X; Resistance: 10kR; Temperature Coefficient: 100ppm/°C; Power Rating: 100mW; Voltage Rating: 50V; LatestRevisionDate: 2-Dec-2009; ComponentLink1URL: http://www.yageo.com/documents/recent/PYu-RC0402_51_RoHS_L_6.pdf; ComponentLink1Description: http://www.yageo.com/documents/recent/PYu-RC0402_51_RoHS_L_6.pdf; Supplier 1: Digi-Key; Supplier Part Number 1: P10.0KLDKR-ND; Stock 1: 28312782; Pricing 1: 1=0.1, 10=0.045, 100=0.0184, 1000=0.00826, 2500=0.00717, 5000=0.00593 (USD); Mount: Surface Mount; Case/Package: 0402; Number of Pins: 2; Contact Plating: Tin; Case Code (Metric): 1005; Case Code (Imperial): 0402; Min Operating Temperature: -55°C; Max Operating Temperature: 155°C; Tolerance: 1%; Composition: Thick Film; Packaging: Tape and Reel; Package Quantity: 1; Number of Terminations: 2; Termination: SMD/SMT; Military Standard: Not; Max Power Dissipation: 100mW; Voltage Rating (DC): 50V; Features: Automotive AEC-Q200; Length: 1mm; Height: 0.35mm; Width: 0.02inch; Depth: 0.5mm; Radiation Hardening: No; REACH SVHC: No SVHC; Lead Free: Lead Free
R10 R28-R32 R36 R40 R42 R46 R55 R56 = Res: RES SMD 470 OHM 5% 1/16W 0402; Manufacturer: Vishay Dale; Manufacturer Part Number: CRCW0402470RJNED; Voltage Rating: 50V; Power Rating: 63mW; Temperature Coefficient: 200ppm/°C; Supplier 1: Digi-Key; Supplier Part Number 1: 541-470JDKR-ND; Stock 1: 1075; Pricing 1: 1=0.1, 10=0.031, 100=0.0125, 1000=0.00563, 2500=0.00488, 5000=0.00403 (USD); Case/Package: 0402; Number of Pins: 2; Weight: 2.3E-05oz; Case Code (Metric): 1005; Case Code (Imperial): 0402; Contact Plating: Tin; Min Operating Temperature: -55°C; Max Operating Temperature: 155°C; Packaging: Tape and Reel; Resistance: 470R; Tolerance: 5%; Composition: Thick Film; Voltage Rating (DC): 50V; Number of Terminations: 2; Termination: SMD/SMT; Package Quantity: 1; Military Standard: Not; Max Power Dissipation: 63mW; Features: Automotive AEC-Q200; Length: 1mm; Height: 0.35mm; Width: 0.02inch; Depth: 0.5mm; Radiation Hardening: No; REACH SVHC: Unknown; Lead Free: Lead Free
R53 = Res: RES SMD 0402 NO LOAD; Value: NO LOAD; ComponentLink2URL: https://datasheet.ciiva.com/46394/1018594-46394951.pdf?src-supplier=Element14; ComponentLink2Description: https://datasheet.ciiva.com/46394/1018594-46394951.pdf?src-supplier=Element14; ComponentLink3URL: https://datasheet.ciiva.com/16741/pyu-rc0402-51-rohs-l-6-r-16741081.pdf?src-supplier=Future+Electronics; ComponentLink3Description: https://datasheet.ciiva.com/16741/pyu-rc0402-51-rohs-l-6-r-16741081.pdf?src-supplier=Future+Electronics; ComponentLink4URL: https://datasheet.ciiva.com/7849/1018594-7849882.pdf?src-supplier=Element14; ComponentLink4Description: https://datasheet.ciiva.com/7849/1018594-7849882.pdf?src-supplier=Element14; ComponentLink5URL: https://datasheet.ciiva.com/7849/1018594-7849883.pdf?src-supplier=Element14; ComponentLink5Description: https://datasheet.ciiva.com/7849/1018594-7849883.pdf?src-supplier=Element14
R54 = Res: RES SMD 1M OHM 1% 1/16W 0402; Manufacturer 1: Yageo; Manufacturer Part Number 1: RC0402FR-071ML; Resistance: 1MR; Power Rating: 63mW; Voltage Rating: 50V; Temperature Coefficient: 100ppm/°C; Supplier 1: Digi-Key; Supplier Part Number 1: 311-1.00MLRCT-ND; Stock 1: 13180955; Pricing 1: 1=0.10000, 10=0.01600, 100=0.00670, 1000=0.00301, 2500=0.00261, 5000=0.00215 (USD); RoHS: Yes; Case/Package: 0402; Case Code (Imperial): 0402; Case Code (Metric): 1005; Min Operating Temperature: -55°C; Max Operating Temperature: 155°C; Composition: Thick Film; Packaging: Tape and Reel; Tolerance: 1%; Termination: SMD/SMT; Military Standard: Not; Length: 1mm; Height: 0.32mm; Depth: 0.5mm; REACH SVHC: Unknown; Lead Free: Lead Free; ComponentLink1URL: https://datasheet.ciiva.com/11808/0900766b80c66297-11808125.pdf?src-supplier=RSComponents; ComponentLink1Description: https://datasheet.ciiva.com/11808/0900766b80c66297-11808125.pdf?src-supplier=RSComponents; ComponentLink2URL: https://datasheet.ciiva.com/46394/1018594-46394951.pdf?src-supplier=Element14; ComponentLink2Description: https://datasheet.ciiva.com/46394/1018594-46394951.pdf?src-supplier=Element14; ComponentLink3URL: https://datasheet.ciiva.com/16741/pyu-rc0402-51-rohs-l-6-r-16741081.pdf?src-supplier=Future+Electronics; ComponentLink3Description: https://datasheet.ciiva.com/16741/pyu-rc0402-51-rohs-l-6-r-16741081.pdf?src-supplier=Future+Electronics; ComponentLink4URL: https://datasheet.ciiva.com/7849/1018594-7849882.pdf?src-supplier=Element14; ComponentLink4Description: https://datasheet.ciiva.com/7849/1018594-7849882.pdf?src-supplier=Element14; ComponentLink5URL: https://datasheet.ciiva.com/7849/1018594-7849883.pdf?src-supplier=Element14; ComponentLink5Description: https://datasheet.ciiva.com/7849/1018594-7849883.pdf?src-supplier=Element14
S1-S3 = Switch SPST: SWITCH TACTILE SPST-NO 0.05A 16V; Manufacturer: ITT C&K; Manufacturer Part Number: PTS810SJK250SMTRLFS; Mechanical Life: 50000Cycles; Operating Force: 260gf; Max Current Rating: 50mA; Illumination Type: Non-Illuminated; Switch Travel: 0.15mm; Switch Function: Off-Mom; Actuator Type: Standard; Supplier 1: Digi-Key; Supplier Part Number 1: CKN10503DKR-ND; Stock 1: 85168; Pricing 1: 1=0.3, 10=0.287, 25=0.2768, 50=0.267, 100=0.2521, 250=0.23728, 500=0.2274, 1000=0.17302 (USD); Mount: Surface Mount; Case/Package: SMD/SMT; Colour: White; Contact Plating: Silver; Min Operating Temperature: -40°C; Max Operating Temperature: 85°C; Throw Configuration: SPST; Packaging: Tape and Reel; Termination: J-Bend; Current Rating: 50mA; Voltage Rating (DC): 16V; Package Quantity: 1; Orientation: Straight; Length: 3.2mm; Depth: 4.6mm; Lead Free: Lead Free; ComponentLink1URL: https://www.ckswitches.com/media/1476/pts810.pdf; ComponentLink1Description: https://www.ckswitches.com/media/1476/pts810.pdf
U2 = SN74LVC2G86DCUR: IC GATE XOR 2CH 2-INP US8; Manufacturer: Texas Instruments; VCC(Min)(V): 1.65; VCC(Max)(V): 5.5; Output Type: CMOS; ICC @ Nom Voltage(Max)(mA): 0.01; Input Type: CMOS/TTL; Bits(#): 2; F @ Nom Voltage(Max)(Mhz): 150; Rating: Catalog; Technology Family: LVC; Voltage(Nom)(V): 1.8,2.5,3.3,5; Schmitt Trigger: No; Output Drive (IOL/IOH)(Max)(mA): 32/-32; tpd @ Nom Voltage(Max)(ns): 11,6.7,5.6,4.2; Logic: True; Sub-Family: XOR Gate; Min Supply Voltage: 1.65V; Max Supply Voltage: 5.5V; Logic Function: OR,XOR; Quiescent Current: 10uA; Number of Outputs: 1; Propagation Delay: 3.6ns; High Level Output Current: -32mA; Low Level Output Current: 32mA; Turn-On Delay Time: 4.7ns; Output Current: 50mA; DatasheetVersion: SCES360I; PackageReference: DCU0008A; Supplier 1: Mouser; Supplier Part Number 1: 595-SN74LVC2G86DCUR; Supplier 2: Digi-Key; Supplier Part Number 2: 296-13275-2-ND; Supplier 3: Digi-Key; Supplier Part Number 3: 296-13275-1-ND; Supplier 4: Digi-Key; Supplier Part Number 4: 296-13275-6-ND; Generic Part Number: SN74LVC2G86; Operating Temperature Range(C): -40 to 125,-40 to 85; 3-State Output: No; PartNumber: SN74LVC2G86DCUR; ComponentLink1Description: Manufacturer URL; ComponentLink1URL: http://www.ti.com/; ComponentLink2Description: Datasheet; ComponentLink2URL: http://www.ti.com/lit/ds/symlink/sn74lvc2g86.pdf; Manufacturer Part Number: SN74LVC2G86DCUR; Stock 4: 7530; Pricing 4: 1=0.55, 10=0.467, 100=0.349, 500=0.27418, 1000=0.21187 (USD); Mount: Surface Mount; Case/Package: VSSOP; Number of Pins: 8; Weight: 0.000339oz; Contact Plating: Gold; Min Operating Temperature: -40°C; Max Operating Temperature: 125°C; Number of Inputs: 2; Packaging: Tape and Reel; Package Quantity: 1; Number of Elements: 2; Number of Circuits: 2; Number of Gates: 2; Number of Input Lines: 2; Number of Output Lines: 1; Number of Bits: 2; Schmitt Trigger Input: No; Length: 2.3mm; Height: 0.85mm; Width: 2mm; Radiation Hardening: No; Lead Free: Lead Free; REACH SVHC: No SVHC
U3 = ATSAME70-144: IC MCU 32BIT 1MB FLASH 144LFBGA; Manufacturer: Microchip; Manufacturer Part Number: ATSAME70Q20B-CNT; ComponentLink1Description: Digikey; ComponentLink1URL: https://www.digikey.com/product-detail/en/microchip-technology/ATSAME70Q20B-CNT/ATSAME70Q20B-CNTCT-ND/8275605; Supplier 1: Digi-Key; Supplier Part Number 1: ATSAME70Q20B-CNTDKR-ND; Stock 1: 2000; Pricing 1: 1=12.84, 25=11.6804, 100=10.5782 (USD)
Y1 = Crystal: CRYSTAL 32.7680KHZ 9PF SMD; Manufacturer: Abracon LLC; Manufacturer Part Number: ABS06-32.768KHZ-9-1-T; Frequency Tolerance: ±10ppm; ESR (Equivalent Series Resistance): 90 kOhm; Operating Mode: Fundamental; Supplier 1: Digi-Key; Supplier Part Number 1: 535-10247-1-ND; RoHS: RoHS Compliant; Category: Crystals and Oscillators; Stock 1: 12198; Pricing 1: 1=1.2, 10=1.153, 50=1.1272, 100=0.9639, 500=0.9384, 1000=0.7905 (USD); Packaging: Cut Tape (CT); Type: kHz Crystal (Tuning Fork); Frequency: 32.768kHz; Frequency Stability: -; Load Capacitance: 9pF; Operating Temperature: -40°C ~ 85°C; Ratings: -; Mounting Type: Surface Mount; Package / Case: 2-SMD; Size / Dimension: 0.079" L x 0.047" W (2.00mm x 1.20mm); Height: 0.024" (0.60mm); ComponentLink1URL: http://www.abracon.com/Resonators/ABS06.pdf; ComponentLink1Description: http://www.abracon.com/Resonators/ABS06.pdf
Y2 = Oscillator2: OSC XO 12.000MHZ HCMOS SMD; Manufacturer: ECS Inc.; Manufacturer Part Number: ECS-2520S33-120-FN-TR; Function: Standby (Power Down); Voltage - Supply: 3.3 V; Frequency Stability: ±10ppm; Current - Supply (Max): 7mA; Current - Supply (Disable) (Max): 10µA; Supplier 1: Digi-Key; Supplier Part Number 1: XC2194TR-ND; RoHS: RoHS Compliant; Category: Crystals and Oscillators; Stock 1: 1641; Pricing 1: 1000=0.85, 3000=0.84, 5000=0.81 (USD); Packaging: Tape & Reel (TR); Type: XO (Standard); Frequency: 12MHz; Output: HCMOS; Operating Temperature: -40°C ~ 85°C; Ratings: -; Mounting Type: Surface Mount; Size / Dimension: 0.098" L x 0.079" W (2.50mm x 2.00mm); Height: 0.039" (1.00mm); Package / Case: 4-SMD, No Lead (DFN, LCC); ComponentLink1URL: https://www.ecsxtal.com/store/pdf/ECS-2520S.pdf; ComponentLink1Description: https://www.ecsxtal.com/store/pdf/ECS-2520S.pdf